# Altium project STM32.PrjPcb
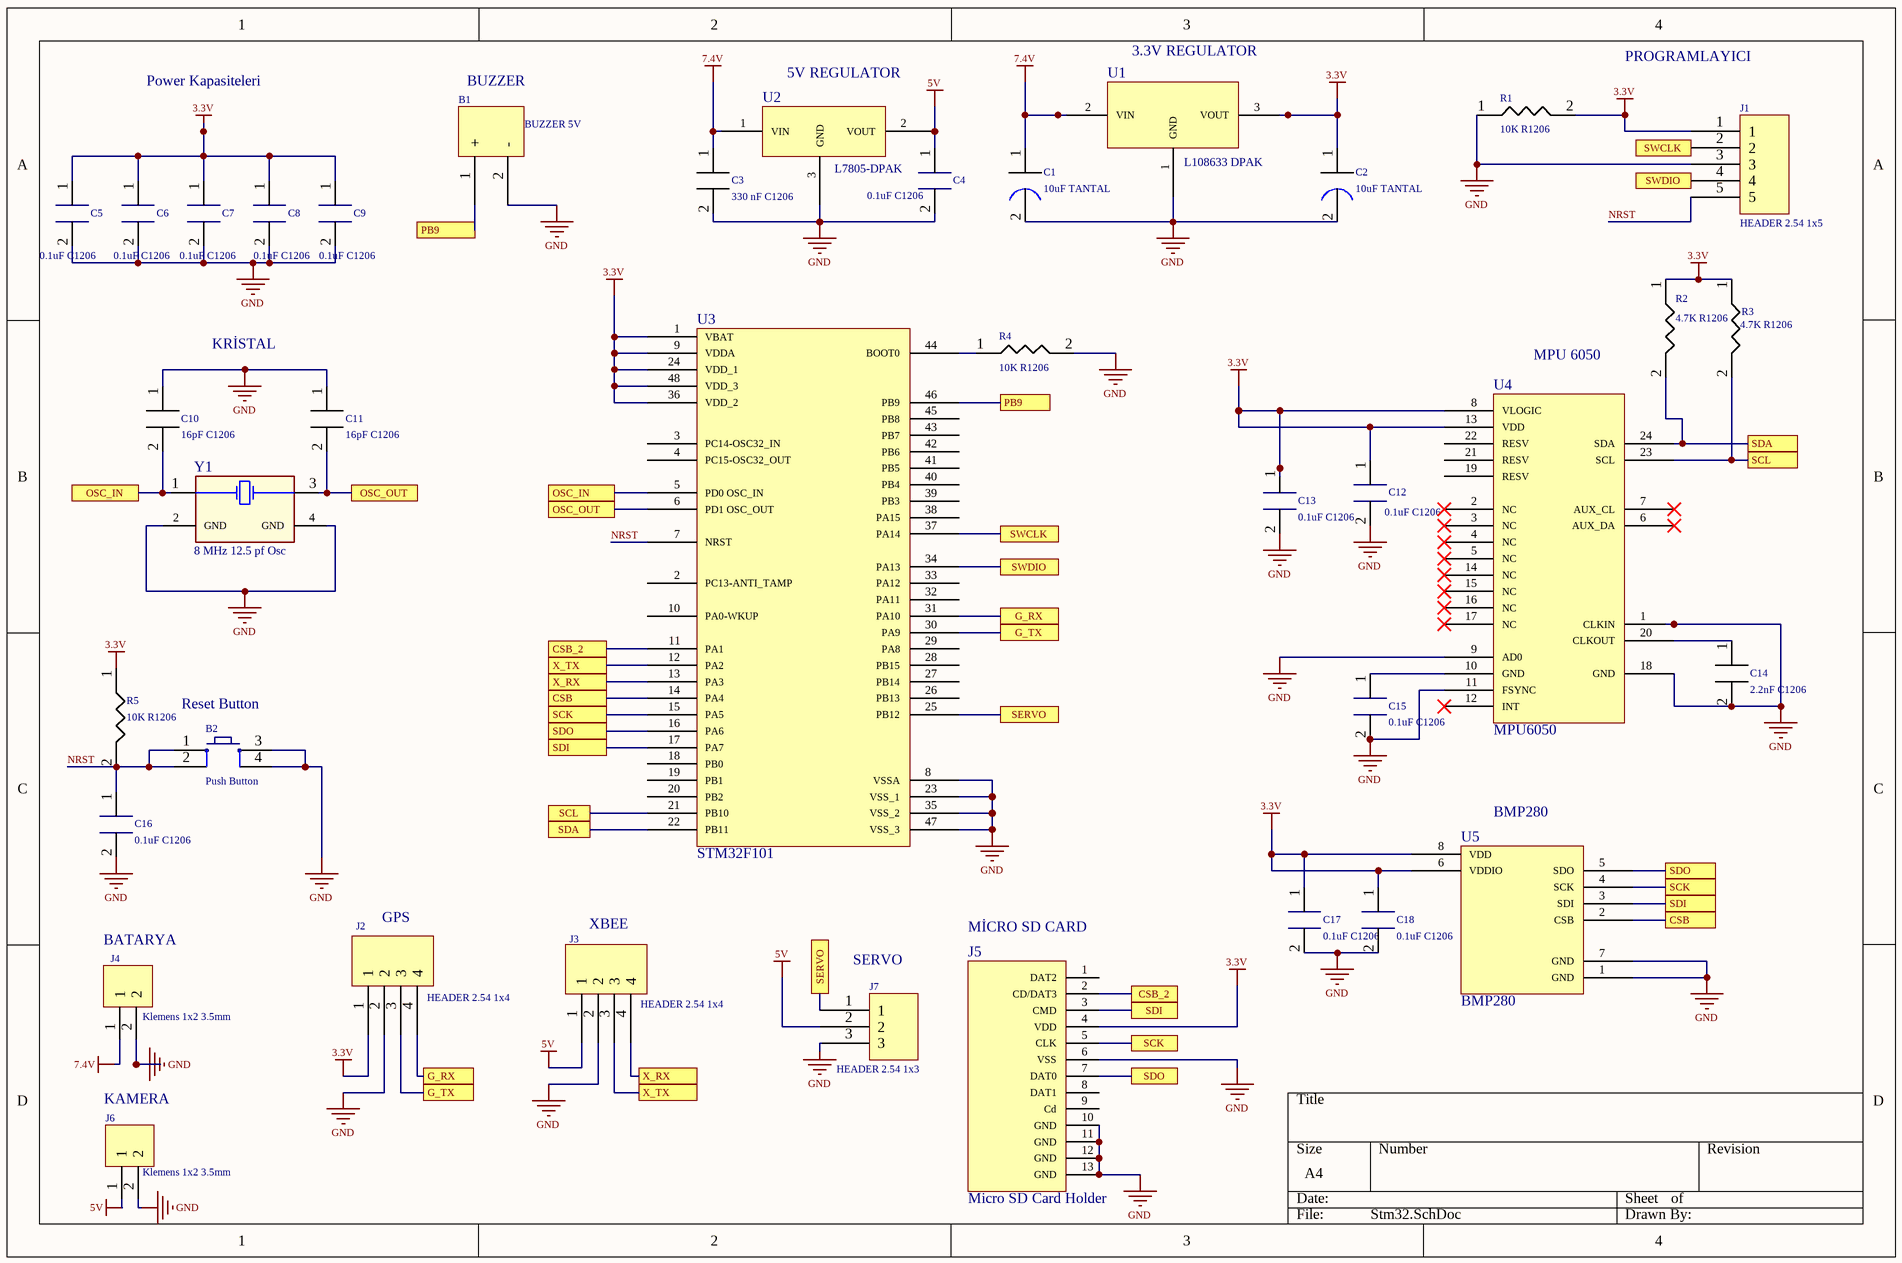
[diagram p0: Stm32.SchDoc]
1 sheet, 38 parts. Net scope: flat (ports and power ports of the same name join across sheets).
Board file: Stm32.PcbDoc

## Sheet Stm32.SchDoc
size A4

### Parts
B1  BUZZER 5V  [BUZZER 5V]
B2  Push Button  [PUSB BUTTON-SMD]
C1  10uF TANTAL  [C1206- TANTAL]
C2  10uF TANTAL  [C1206- TANTAL]
C3  330 nF C1206  [C1206]
C4  0.1uF C1206  [C1206]
C5  0.1uF C1206  [C1206]
C6  0.1uF C1206  [C1206]
C7  0.1uF C1206  [C1206]
C8  0.1uF C1206  [C1206]
C9  0.1uF C1206  [C1206]
C10  16pF C1206  [C1206]
C11  16pF C1206  [C1206]
C12  0.1uF C1206  [C1206]
C13  0.1uF C1206  [C1206]
C14  2.2nF C1206  [C1206]
C15  0.1uF C1206  [C1206]
C16  0.1uF C1206  [C1206]
C17  0.1uF C1206  [C1206]
C18  0.1uF C1206  [C1206]
J1  HEADER 2.54 1x5  [HEADER 2.54 1x5]
J2  HEADER 2.54 1x4  [Header 2.54 1x4]
J3  HEADER 2.54 1x4  [Header 2.54 1x4]
J4  Klemens 1x2 3.5mm  [Klemens 1x2 - 3.5mm]
J5  Micro SD Card Holder  [Micro SD Kart Holder]
J6  Klemens 1x2 3.5mm  [Klemens 1x2 - 3.5mm]
J7  HEADER 2.54 1x3  [Header 2.54 1x3]
R1  10K R1206  [R1206 Resıstor]
R2  4.7K R1206  [R1206 Resıstor]
R3  4.7K R1206  [R1206 Resıstor]
R4  10K R1206  [R1206 Resıstor]
R5  10K R1206  [R1206 Resıstor]
U1  L108633 DPAK  [DPAK228P972X230-3N]
U2  L7805-DPAK  [DPAK228P972X230-3N]
U3  STM32F101  [LQFP48-STM]
U4  MPU6050  [QFN50P400X400X90_HS-25N]
U5  BMP280  [BMP280]
Y1  8 MHz 12.5 pf Osc  [8 MHZ Osc.]

### Ports
CSB, CSB_2, G_RX, G_TX, OSC_IN, OSC_OUT, PB9, SCK, SCL, SDA, SDI, SDO, SERVO, SWCLK, SWDIO, X_RX, X_TX

### Nets
3.3V: C2.1 C5.1 C6.1 C7.1 C8.1 C9.1 C12.1 C13.1 C17.1 C18.1 J1.1 J2.1 J5.4(VDD) R1.2 R2.1 R3.1 R5.1 U1.3(VOUT) U3.1(VBAT) U3.9(VDDA) U3.24(VDD_1) U3.36(VDD_2) U3.48(VDD_3) U4.8(VLOGIC) U4.13(VDD) U5.6(VDDIO) U5.8(VDD)
5V: C4.1 J3.1 J6.1 J7.2 U2.2(VOUT)
7.4V: C1.1 C3.1 J4.1 U1.2(VIN) U2.1(VIN)
GND: B1.2(-) B2.3 B2.4 C1.2 C2.2 C3.2 C4.2 C5.2 C6.2 C7.2 C8.2 C9.2 C10.1 C11.1 C12.2 C13.2 C14.2 C15.2 C16.2 C17.2 C18.2 J1.3 J2.2 J3.2 J4.2 J5.6(VSS) J5.10(GND) J5.11(GND) J5.12(GND) J5.13(GND) J6.2 J7.3 R1.1 R4.2 U1.1(GND) U2.3(GND) U3.8(VSSA) U3.23(VSS_1) U3.35(VSS_2) U3.47(VSS_3) U4.1(CLKIN) U4.9(AD0) U4.11(FSYNC) U4.18(GND) U5.1(GND) U5.7(GND) Y1.2(GND) Y1.4(GND)
NRST: B2.1 B2.2 C16.1 J1.5 R5.2 U3.7(NRST)
NetB1_1: B1.1(+) U3.46(PB9) ; port PB9
NetC10_2: C10.2 U3.5(PD0_OSC_IN) Y1.1 ; port OSC_IN
NetC11_2: C11.2 U3.6(PD1_OSC_OUT) Y1.3 ; port OSC_OUT
NetC14_1: C14.1 U4.20(CLKOUT)
NetC15_1: C15.1 U4.10(GND)
NetJ1_2: J1.2 U3.37(PA14) ; port SWCLK
NetJ1_4: J1.4 U3.34(PA13) ; port SWDIO
NetJ2_3: J2.3 U3.30(PA9) ; port G_TX
NetJ2_4: J2.4 U3.31(PA10) ; port G_RX
NetJ3_3: J3.3 U3.12(PA2) ; port X_TX
NetJ3_4: J3.4 U3.13(PA3) ; port X_RX
NetJ5_2: J5.2(CD/DAT3) U3.11(PA1) ; port CSB_2
NetJ5_3: J5.3(CMD) U3.17(PA7) U5.3(SDI) ; port SDI
NetJ5_5: J5.5(CLK) U3.15(PA5) U5.4(SCK) ; port SCK
NetJ5_7: J5.7(DAT0) U3.16(PA6) U5.5(SDO) ; port SDO
NetJ7_1: J7.1 U3.25(PB12) ; port SERVO
NetR2_2: R2.2 U3.22(PB11) U4.24(SDA) ; port SDA
NetR3_2: R3.2 U3.21(PB10) U4.23(SCL) ; port SCL
NetR4_1: R4.1 U3.44(BOOT0)
NetU3_14: U3.14(PA4) U5.2(CSB) ; port CSB

Not connected (* = marked no-connect by the designer): J5 1(DAT2) 8(DAT1) 9(Cd); U3 2(PC13-ANTI_TAMP) 3(PC14-OSC32_IN) 4(PC15-OSC32_OUT) 10(PA0-WKUP) 18(PB0) 19(PB1) 20(PB2) 26(PB13) 27(PB14) 28(PB15) 29(PA8) 32(PA11) 33(PA12) 38(PA15) 39(PB3) 40(PB4) 41(PB5) 42(PB6) 43(PB7) 45(PB8); U4 2(NC)* 3(NC)* 4(NC)* 5(NC)* 6(AUX_DA)* 7(AUX_CL)* 12(INT)* 14(NC)* 15(NC)* 16(NC)* 17(NC)* 19(RESV) 21(RESV) 22(RESV)

### Notes on the sheet
- (near U1) 3.3V REGULATOR
- Power Kapasiteleri
- BUZZER
- (near U2) 5V REGULATOR
- PROGRAMLAYICI
- KRİSTAL
- MPU 6050
- (near B2) Reset Button
- (near U5) BMP280
- (near J4) BATARYA
- (near J2) GPS
- (near J3) XBEE
- (near J7) SERVO
- (near J5) MİCRO SD CARD
- KAMERA

### Library data of the parts
B2 = Push Button: Smd Push Button; Satın Alma Linki: https://urun.n11.com/diger/mini-pushbutton-switch-smd-P227461537?gclid=Cj0KCQjwkoDmBRCcARIsAG3xzl8Y_-jeD7HocNM6lvuZ_rVp83568XPGtNzlPwXWLph8oCRqo0yh87UaApZYEALw_wcB&gclsrc=aw.ds
C3 = 330 nF C1206: 330nF C1206
C14 = 2.2nF C1206: 10nF C1206
U1 = L108633 DPAK: LD1086 3.3V REGULATOR
U2 = L7805-DPAK: L7805 5V REGULATÖR SMD PAKET
U3 = STM32F101: STM32F101 48 PİNLİ MİKROİŞLEMCİ
U4 = MPU6050: MPU6050 GYRO
U5 = BMP280: BMP280 SENSOR